# Altium schematic sheet Air Quality Sensors.SchDoc: Air Quality Sensors
size B; CompanyName: Drexel University; Organization: Drexel University; Address1: ECE Senior Design; Address2: 2018-2019; Address3: ECE-08; Revision: 1.0; SheetNumber: 9; SheetTotal: 10
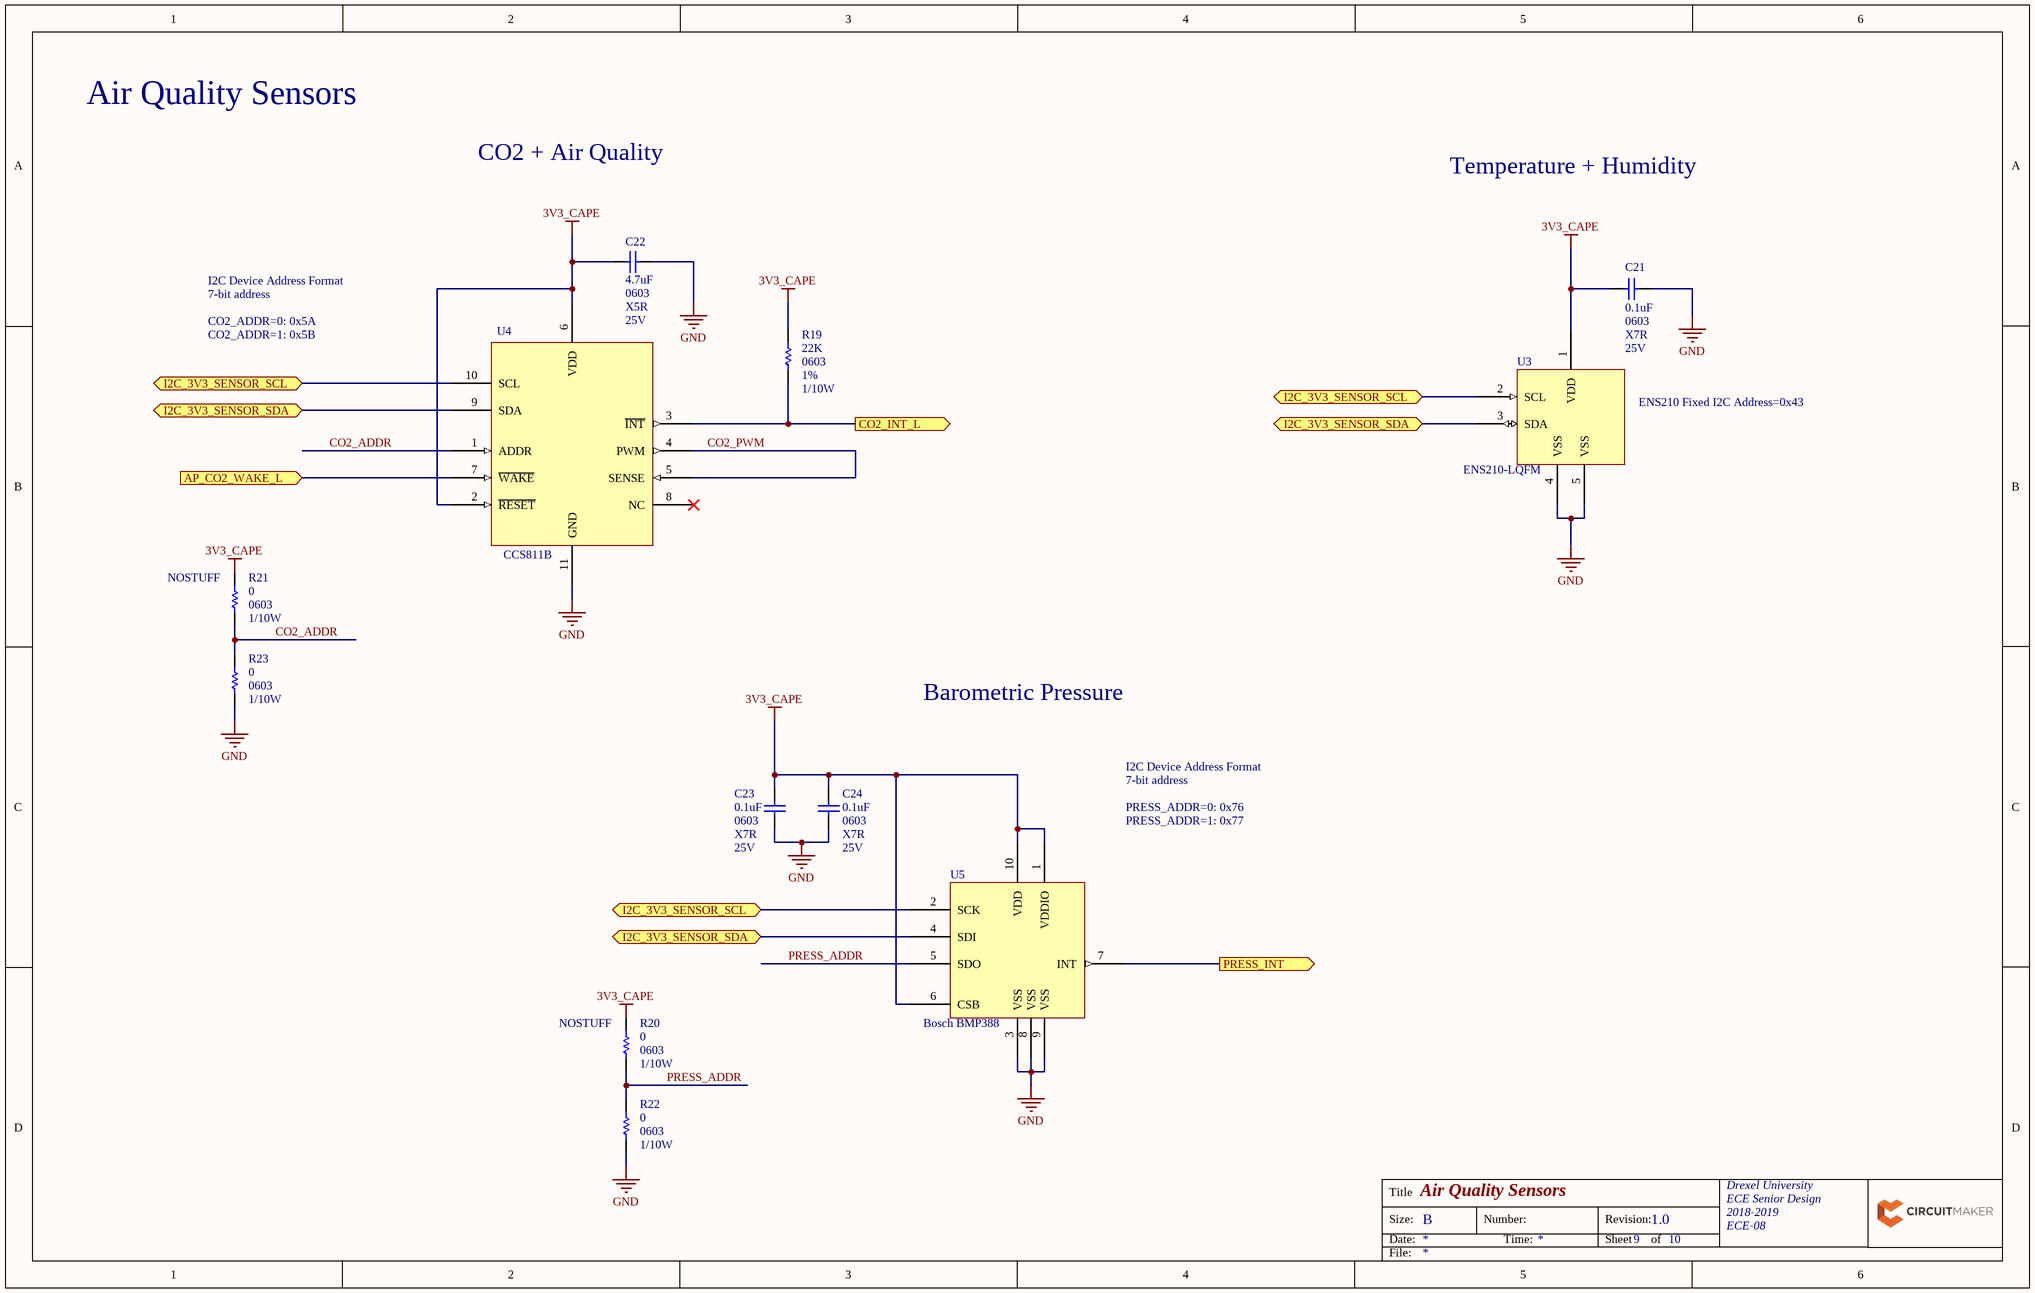
[diagram p0: Air Quality Sensors.SchDoc]

## Parts
C21  Dielectric Characteristic: X7R  Voltage Rating (DC): 25V  Capacitance: 0.1uF  Package: 0603  [PCB-8usp83j76ntw2xroyu3n-1]  (hidden comment: Würth Elektronik 885012206071)
C22  Capacitance: 4.7uF  Case/Package: 0603  Dielectric Characteristic: X5R  Voltage Rating (DC): 25V  [CAPC1608X90X35ML10T15]  (hidden comment: Murata GRM188R61E475KE11D)
C23  Dielectric Characteristic: X7R  Voltage Rating (DC): 25V  Capacitance: 0.1uF  Package: 0603  [PCB-8usp83j76ntw2xroyu3n-1]  (hidden comment: Würth Elektronik 885012206071)
C24  Dielectric Characteristic: X7R  Voltage Rating (DC): 25V  Capacitance: 0.1uF  Package: 0603  [PCB-8usp83j76ntw2xroyu3n-1]  (hidden comment: Würth Elektronik 885012206071)
R19  Resistance: 22K  Resistance Tolerance: 1%  Case/Package: 0603  Power Rating: 1/10W  [RESC1608X55X25LL10T15]  (hidden comment: Yageo RC0603FR-0722KL)
R20  Supplier Device Package: 0603  Resistance: 0  Power: 1/10W  [PCB-vghjuybc2rzv8513tm8h-1]  (hidden comment: Res1)
R21  Supplier Device Package: 0603  Resistance: 0  Power: 1/10W  [PCB-vghjuybc2rzv8513tm8h-1]  (hidden comment: Res1)
R22  Supplier Device Package: 0603  Resistance: 0  Power: 1/10W  [PCB-vghjuybc2rzv8513tm8h-1]  (hidden comment: Res1)
R23  Supplier Device Package: 0603  Resistance: 0  Power: 1/10W  [PCB-vghjuybc2rzv8513tm8h-1]  (hidden comment: Res1)
U3  ENS210-LQFM  [DFN95P200X80-4N]
U4  CCS811B  [CCS811B]
U5  Bosch BMP388  [BMP388]

## Ports
AP_CO2_WAKE_L (in), CO2_INT_L (out), I2C_3V3_SENSOR_SCL, I2C_3V3_SENSOR_SDA, PRESS_INT (out)

## Nets
3V3_CAPE: C21.1 C22.2 C23.2 C24.2 R19.2 R20.2 R21.2 U3.1(VDD) U4.2(~{RESET}) U4.6(VDD) U5.1(VDDIO) U5.6(CSB) U5.10(VDD)
GND: C21.2 C22.1 C23.1 C24.1 R22.1 R23.1 U3.4(VSS) U3.5(VSS) U4.11(GND) U5.3(VSS) U5.8(VSS) U5.9(VSS)
AP_CO2_WAKE_L: U4.7(~{WAKE}) ; port AP_CO2_WAKE_L
CO2_ADDR: R21.1 R23.2 U4.1(ADDR)
CO2_INT_L: R19.1 U4.3(~{INT}) ; port CO2_INT_L
CO2_PWM: U4.4(PWM) U4.5(SENSE)
I2C_3V3_SENSOR_SCL: U3.2(SCL) U4.10(SCL) U5.2(SCK) ; port I2C_3V3_SENSOR_SCL
I2C_3V3_SENSOR_SDA: U3.3(SDA) U4.9(SDA) U5.4(SDI) ; port I2C_3V3_SENSOR_SDA
PRESS_ADDR: R20.1 R22.2 U5.5(SDO)
PRESS_INT: U5.7(INT) ; port PRESS_INT

Not connected (* = marked no-connect by the designer): U4 8(NC)*

## Notes on the sheet
- Air Quality Sensors
- CO2 + Air Quality
- Temperature + Humidity
- I2C Device Address Format
- 7-bit address
- CO2_ADDR=0: 0x5A
- CO2_ADDR=1: 0x5B
- ENS210 Fixed I2C Address=0x43
- Barometric Pressure
- PRESS_ADDR=0: 0x76
- PRESS_ADDR=1: 0x77
- Title
- Size:
- Date:
- B
- Number:
- Time:
- Revision:
- Sheet
- of
- File:
- (in symbol CMP-536b9a7387ce8cac-9) NOSTUFF

## Library data of the parts
C21 C23 C24 = CMP-034ac9768ab0dc8d-1: Multilayer Ceramic Capacitor, WCAP-CSGP Series, 0.1 F, 10%, X7R, 25 V, 0603 [1608 Metric]; RoHS: Compliant; Capacitance Tolerance: ±10%; OctopartID: 034ac9768ab0dc8d; Packaging: Cut Tape (CT); Octopart URL: http://octopart.com/885012206071-w%C3%BCrth+elektronik-53914780; Manufacturer Part Number: 885012206071
C22 = CMP-8856396-4: CAP CER 4.7UF 25V 10% X5R 0603; Capacitance Tolerance: ±10%; Lifecycle Status: Active; Octopart Url: https://octopart.com/grm188r61e475ke11d-murata-26982327; OctopartID: 0176c9e793a7deb1; Packaging: Cut Tape (CT); REACH SVHC Compliance: No SVHC; RoHS: Compliant; Size-Length: 0.0016 m; Size-Thickness: 0.0008 m; Size-Width: 0.0008 m; Manufacturer Part Number: GRM188R61E475KE11D
R19 = CMP-1853446-5: Chip Resistor, 22 KOhm, +/- 1%, 0.1 W, -55 to 155 degC, 0603 (1608 Metric), RoHS, Tape and Reel; Voltage Rating (DC): 50.0 V; Lead-Free Status: Lead Free; Case/Package (SI): 1608; Number of Pins: 2; Size-Height: 450 µm; PackageDescription: 2-Pin Surface Mount Device, Body 1.6 x 0.8 mm; Size-Width: 800 µm; Seller Landing  Url: https://octopart-clicks.com/click/track?country=US&ak=8157f166&sig=0952a08&sid=5489&ppid=40952860&vpid=270386233&ct=offers; DatasheetVersion: Rev. 4, 02/2016; PackageReference: 0603; Size-Length: 1.60 mm; RoHS: Compliant; Mounting Style: Surface Mount; OctopartID: 2162ea18e018fea5; Manufacturer Part Number: RC0603FR-0722KL; Packaging: Cut Tape (CT), Tape & Reel (TR); Octopart Url: http://octopart.com/rc0603fr-0722kl-yageo-40952860; REACH SVHC Compliance: No SVHC
R20-R23 = CMP-536b9a7387ce8cac-9: RES SMD 0 OHM JUMPER 1/10W 0603; Manufacturer Part Number: RC0603JR-070RL; Package / Case: 0603; Size / Dimension: 0.063" L x 0.032" W (1.60mm x 0.80mm); Features: Moisture Resistant; Series: RC
U3 = CMP-d38f1e156f1a0c48-1: Humidity/Temperature Sensor Digital Serial (2-Wire, I2C) 4-Pin QFN EP T/R; Lead-Free Status: Lead Free; Octopart URL: https://octopart.com/ens210-lqfm-ams-76585459; Manufacturer Part Number: ENS210-LQFM; RoHS: Compliant; OctopartID: d38f1e156f1a0c48
U4 = CMP-1175dd4b038fceb2-3: Low Power Digital Sensor For Ind; Manufacturer Part Number: CCS811B-JOPD500
U5 = CMP-7accb6959f30a50b-7: Pressure Sensor by Bosch Sensortec; Lead-Free Status: Lead Free; OctopartID: 7accb6959f30a50b; Mounting Style: Surface Mount; Octopart URL: https://octopart.com/bmp388-bosch+tools-89374874; Manufacturer Part Number: BMP388